# Altium schematic sheet PowerPinsBlockingLED.SchDoc
size A4; CompanyName: Technische Hochschule Nürnberg Georg Simon Ohm; Address1: Fürther Straße 250; Address2: 90429 Nürnberg; Address3: GERMANY; SheetNumber: 10; SheetTotal: 17; CompanyName2: Institut ELSYS
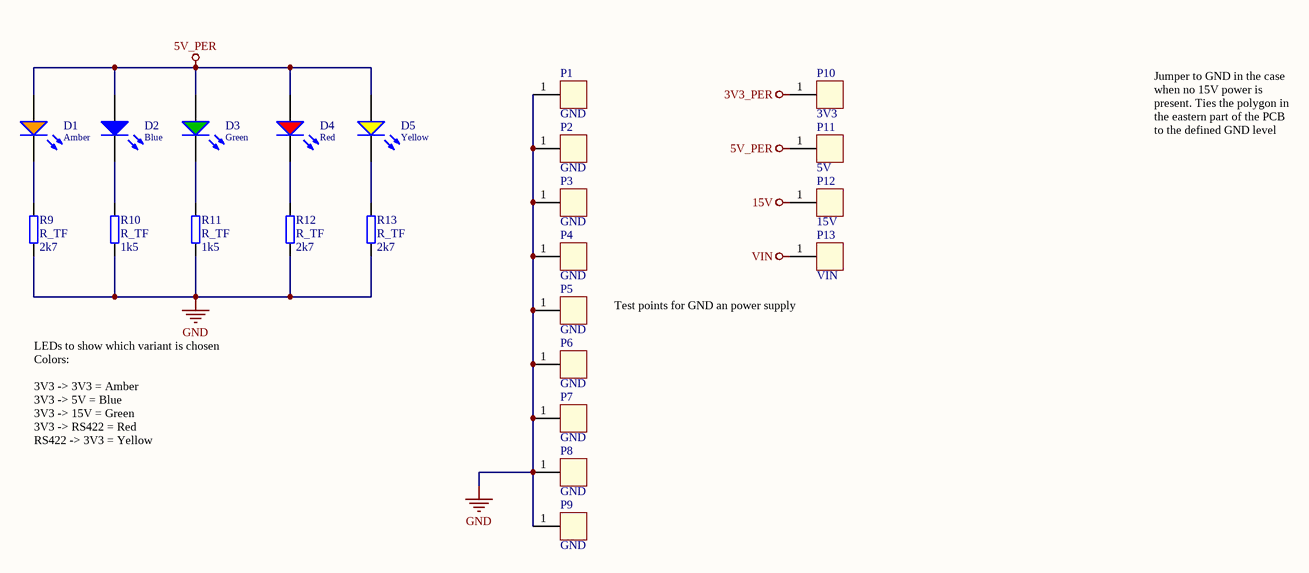
[diagram p0: PowerPinsBlockingLED.SchDoc]

## Parts
D1  Emitting Color: Amber  [WL-SMCW_0603]  (hidden comment: LED_Amber)
D2  Emitting Color: Blue  [WL-SMCW_0603]  (hidden comment: LED_Blue)
D3  Emitting Color: Green  [WL-SMCW_0603]  (hidden comment: LED_Green)
D4  Emitting Color: Red  [WL-SMCW_0603]  (hidden comment: LED_red)
D5  Emitting Color: Yellow  [WL-SMCW_0603]  (hidden comment: LED_Yellow)
P1  GND  [PinHeader1]  (no BOM)
P2  GND  [PinHeader1]  (no BOM)
P3  GND  [PinHeader1]  (no BOM)
P4  GND  [PinHeader1]  (no BOM)
P5  GND  [PinHeader1]  (no BOM)
P6  GND  [PinHeader1]  (no BOM)
P7  GND  [PinHeader1]  (no BOM)
P8  GND  [PinHeader1]  (no BOM)
P9  GND  [PinHeader1]  (no BOM)
P10  3V3  [PinHeader1]  (no BOM)
P11  5V  [PinHeader1]  (no BOM)
P12  15V  [PinHeader1]  (no BOM)
P13  VIN  [PinHeader1]  (no BOM)
R9  R_TF  value 2k7  [RESC1608X55X30NL15T15]
R10  R_TF  value 1k5  [RESC1608X55X30NL15T15]
R11  R_TF  value 1k5  [RESC1608X55X30NL15T15]
R12  R_TF  value 2k7  [RESC1608X55X30NL15T15]
R13  R_TF  value 2k7  [RESC1608X55X30NL15T15]

## Nets
3V3_PER: P10.1
5V_PER: D1.2(A) D2.2(A) D3.2(A) D4.2(A) D5.2(A) P11.1
15V: P12.1
GND: P1.1 P2.1 P3.1 P4.1 P5.1 P6.1 P7.1 P8.1 P9.1 R9.2 R10.2 R11.2 R12.2 R13.2
VIN: P13.1
NetD1_1: D1.1(K) R9.1
NetD2_1: D2.1(K) R10.1
NetD3_1: D3.1(K) R11.1
NetD4_1: D4.1(K) R12.1
NetD5_1: D5.1(K) R13.1

## Notes on the sheet
- Jumper to GND in the case when no 15V power is present. Ties the polygon in the eastern part of the PCB to the defined GND level
- Test points for GND an power supply
- LEDs to show which variant is chosen
  Colors:
  3V3 -> 3V3 = Amber
  3V3 -> 5V = Blue
  3V3 -> 15V = Green
  3V3 -> RS422 = Red
  RS422 -> 3V3 = Yellow
- Title
- Size:
- Date:
- A4
- Revision:
- Time:
- Sheet
- of
- Author:
- Project:

## Library data of the parts
D1 = LED_Amber: WL-SMCW SMD Mono-color Chip LED Waterclear, size 0603, Red, 2 V, 140°; Forward Voltage: 2 V; Luminous Intensity: 250 mcd; Peak Wavelength: 610nm; Dominant Wavelength: 605nm; Value: 150060AS75000; MF: Wuerth Elektronik; Published Date: Sep. 2017; ComponentLink1Description: Manufacturer; ComponentLink1URL: http://www.we-online.de; ComponentLink2Description: Datasheet; ComponentLink2URL: http://katalog.we-online.com/led/datasheet/150060AS75000.pdf; Size: 0603; Viewing Angle: 140°; Package: 0603; Created: 2020-01-07_Thilo_Wendt; Supplier 1: Digi-Key; Supplier Part Number 1: 732-150060AS75000CT-ND; MPN: 150060AS75000; Supplier 2: Mouser; Supplier Part Number 2: 710-150060AS75000; Supplier 3: Farnell
D2 = LED_Blue: WL-SMCW SMD Mono-color Chip LED Waterclear, size 0603, Blue, 3.2 V, 140°; MPN: 150060BS75000; Forward Voltage: 3.2 V; Luminous Intensity: 145 mcd; Peak Wavelength: 465 nm; Dominant Wavelength: 470 nm; MF: Wuerth Elektronik; Value: 150060BS75000; Published Date: Sep. 2017; ComponentLink1Description: Manufacturer; ComponentLink1URL: http://www.we-online.de; ComponentLink2Description: Datasheet; ComponentLink2URL: http://katalog.we-online.com/led/datasheet/150060BS75000.pdf; Size: 0603; Viewing Angle: 140°; Package: 0603; Created: 2018_09_06_AGeiger; Supplier 1: Farnell; Supplier Part Number 1: 2322069; Supplier 2: Mouser; Supplier Part Number 2: 710-150060BS75000; Supplier 3: Digi-Key; Supplier Part Number 3: 732-4966-1-ND
D3 = LED_Green: WL-SMCW SMD Mono-color Chip LED Waterclear, size 0603, Green, 3.2 V, 140°; MPN: 150060GS75000; Forward Voltage: 3.2 V; Luminous Intensity: 430 mcd; Peak Wavelength: 515 nm; Dominant Wavelength: 520 nm; MF: Wuerth Elektronik; Value: 150060GS75000; Published Date: Sep. 2017; ComponentLink1Description: Manufacturer; ComponentLink1URL: http://www.we-online.de; ComponentLink2Description: Datasheet; ComponentLink2URL: http://katalog.we-online.com/led/datasheet/150060GS75000.pdf; Size: 0603; Viewing Angle: 140°; Package: 0603; Created: 2018_09_06_AGeiger; Supplier 1: Farnell; Supplier Part Number 1: 2322070; Supplier 2: Mouser; Supplier Part Number 2: 710-150060GS75000; Supplier 3: Digi-Key; Supplier Part Number 3: 732-4971-1-ND
D4 = LED_Red: WL-SMCW SMD Mono-color Chip LED Waterclear, size 0603, Red, 2 V, 140°; MPN: 150060RS75000; Forward Voltage: 2 V; Luminous Intensity: 250 mcd; Peak Wavelength: 630 nm; Dominant Wavelength: 625 nm; MF: Wuerth Elektronik; Value: 150060RS75000; Published Date: Sep. 2017; ComponentLink1Description: Manufacturer; ComponentLink1URL: http://www.we-online.de; ComponentLink2Description: Datasheet; ComponentLink2URL: http://katalog.we-online.com/led/datasheet/150060RS75000.pdf; Size: 0603; Viewing Angle: 140°; Package: 0603; Created: 2018_09_06_AGeiger; Supplier 1: Farnell; Supplier Part Number 1: 2322071; Supplier 2: Mouser; Supplier Part Number 2: 710-150060RS75000; Supplier 3: Digi-Key; Supplier Part Number 3: 732-4978-1-ND
D5 = LED_Yellow: WL-SMCW SMD Mono-color Chip LED Waterclear, size 0603, Red, 2 V, 140°; Forward Voltage: 2 V; Luminous Intensity: 250 mcd; Peak Wavelength: 595; Dominant Wavelength: 590; Value: 150060YS75000; MF: Wuerth Elektronik; Published Date: Sep. 2017; ComponentLink1Description: Manufacturer; ComponentLink1URL: http://www.we-online.de; ComponentLink2Description: Datasheet; ComponentLink2URL: http://katalog.we-online.com/led/datasheet/150060YS75000.pdf; Size: 0603; Viewing Angle: 140°; Package: 0603; Created: 2020-01-07_Thilo_Wendt; Supplier 1: Mouser; Supplier 2: Farnell; Supplier 3: Digi-Key; Supplier Part Number 1: 710-150060YS75000; Supplier Part Number 2: 2322074; Supplier Part Number 3: 732-4981-1-ND; MPN: 150060YS75000
P1-P13 = PinHeader1: Pin Header with 1 terminal; Created: 2020-01-08_Thilo_Wendt
  P1-P9: Net: GND
  P10: Net: 3V3
  P11: Net: 5V
  P12: Net: 15V
  P13: Net: VIN
R9 R12 R13 = R_0.1W_SMD: Standard thick film resistor; MPN: ERJU03F1501V; Parameter1: V; Parameter1Desc: Package Method; Parameter2: F; Parameter2Desc: Tolerance Symbol; MaxVoltage: 100; MF: Panasonic; Created: 2019-12-08_Thilo_Wendt; Supplier1: https://de.farnell.com/w/search?qualifizierungsstandard-der-automobilindustrie=aec-q200&range=inc-in-stock&st=erju; Package: RESC1608X55X30NL15T15; HelpURL: https://www.mouser.de/datasheet/2/315/AOA0000C334-1314047.pdf; Parameter3: *; Parameter3Desc: *; ComponentLink1Description: Datasheet; ComponentLink1URL: https://www.mouser.de/datasheet/2/315/AOA0000C334-1314047.pdf
R10 R11 = R_0.1W_SMD: Standard thick film resistor; MPN: ERJU03F2701V; Parameter1: V; Parameter1Desc: Package Method; Parameter2: F; Parameter2Desc: Tolerance Symbol; MaxVoltage: 100; MF: Panasonic; Created: 2019-12-08_Thilo_Wendt; Supplier1: https://de.farnell.com/w/search?qualifizierungsstandard-der-automobilindustrie=aec-q200&range=inc-in-stock&st=erju; Package: RESC1608X55X30NL15T15; HelpURL: https://www.mouser.de/datasheet/2/315/AOA0000C334-1314047.pdf; Parameter3: *; Parameter3Desc: *; ComponentLink1Description: Datasheet; ComponentLink1URL: https://www.mouser.de/datasheet/2/315/AOA0000C334-1314047.pdf